# Altium schematic sheet Connector.SchDoc
size A
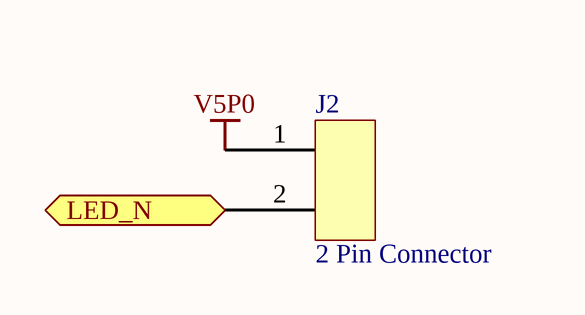
[diagram p0: Connector.SchDoc]

## Parts
J2  2 Pin Connector  [2pin smd pad for LED connector]

## Ports
LED_N (out)

## Nets
V5P0: J2.1
LED_N: J2.2 ; port LED_N